# Altium schematic sheet PROC010B_DUT_Reference.SchDoc
size 431 x 279 mm; Date: Not shown in title block; ApprovedBy: Not shown in title block; CheckedBy: Not shown in title block; Author: Not shown in title block; CompanyName: Not shown in title block; DrawnBy: Adrian Ozer; Engineer: Not shown in title block; Organization: Not shown in title block; Address1: Not shown in title block; Address2: Not shown in title block; Address3: Not shown in title block; Address4: Not shown in title block; DocumentNumber: 2; Revision: Use project parameter SCH_Rev; SheetNumber: 2; SheetTotal: 16; PageSetup: Record=PageOptions|CenterHorizontal=True|CenterVertical=True|PrintScale=1.00|XCorrection=1.00|YCorrection=1.00|PrintKind=0|BorderSize=5000000|LeftOffset=0|BottomOffset=0|Orientation=2|PaperLength=1000|PaperWidth=1000|Scale=100|PaperSource=15|PrintQuality=600|MediaType=1|DitherType=10|PaperKind=Letter|PrintScaleMode=1; CurrentTime: Not shown in title block; CurrentDate: Not shown in title block; Time: Not shown in title block; DocumentFullPathAndName: Not shown in title block; DocumentName: Not shown in title block; ModifiedDate: Not shown in title block; ImagePath: Not shown in title block
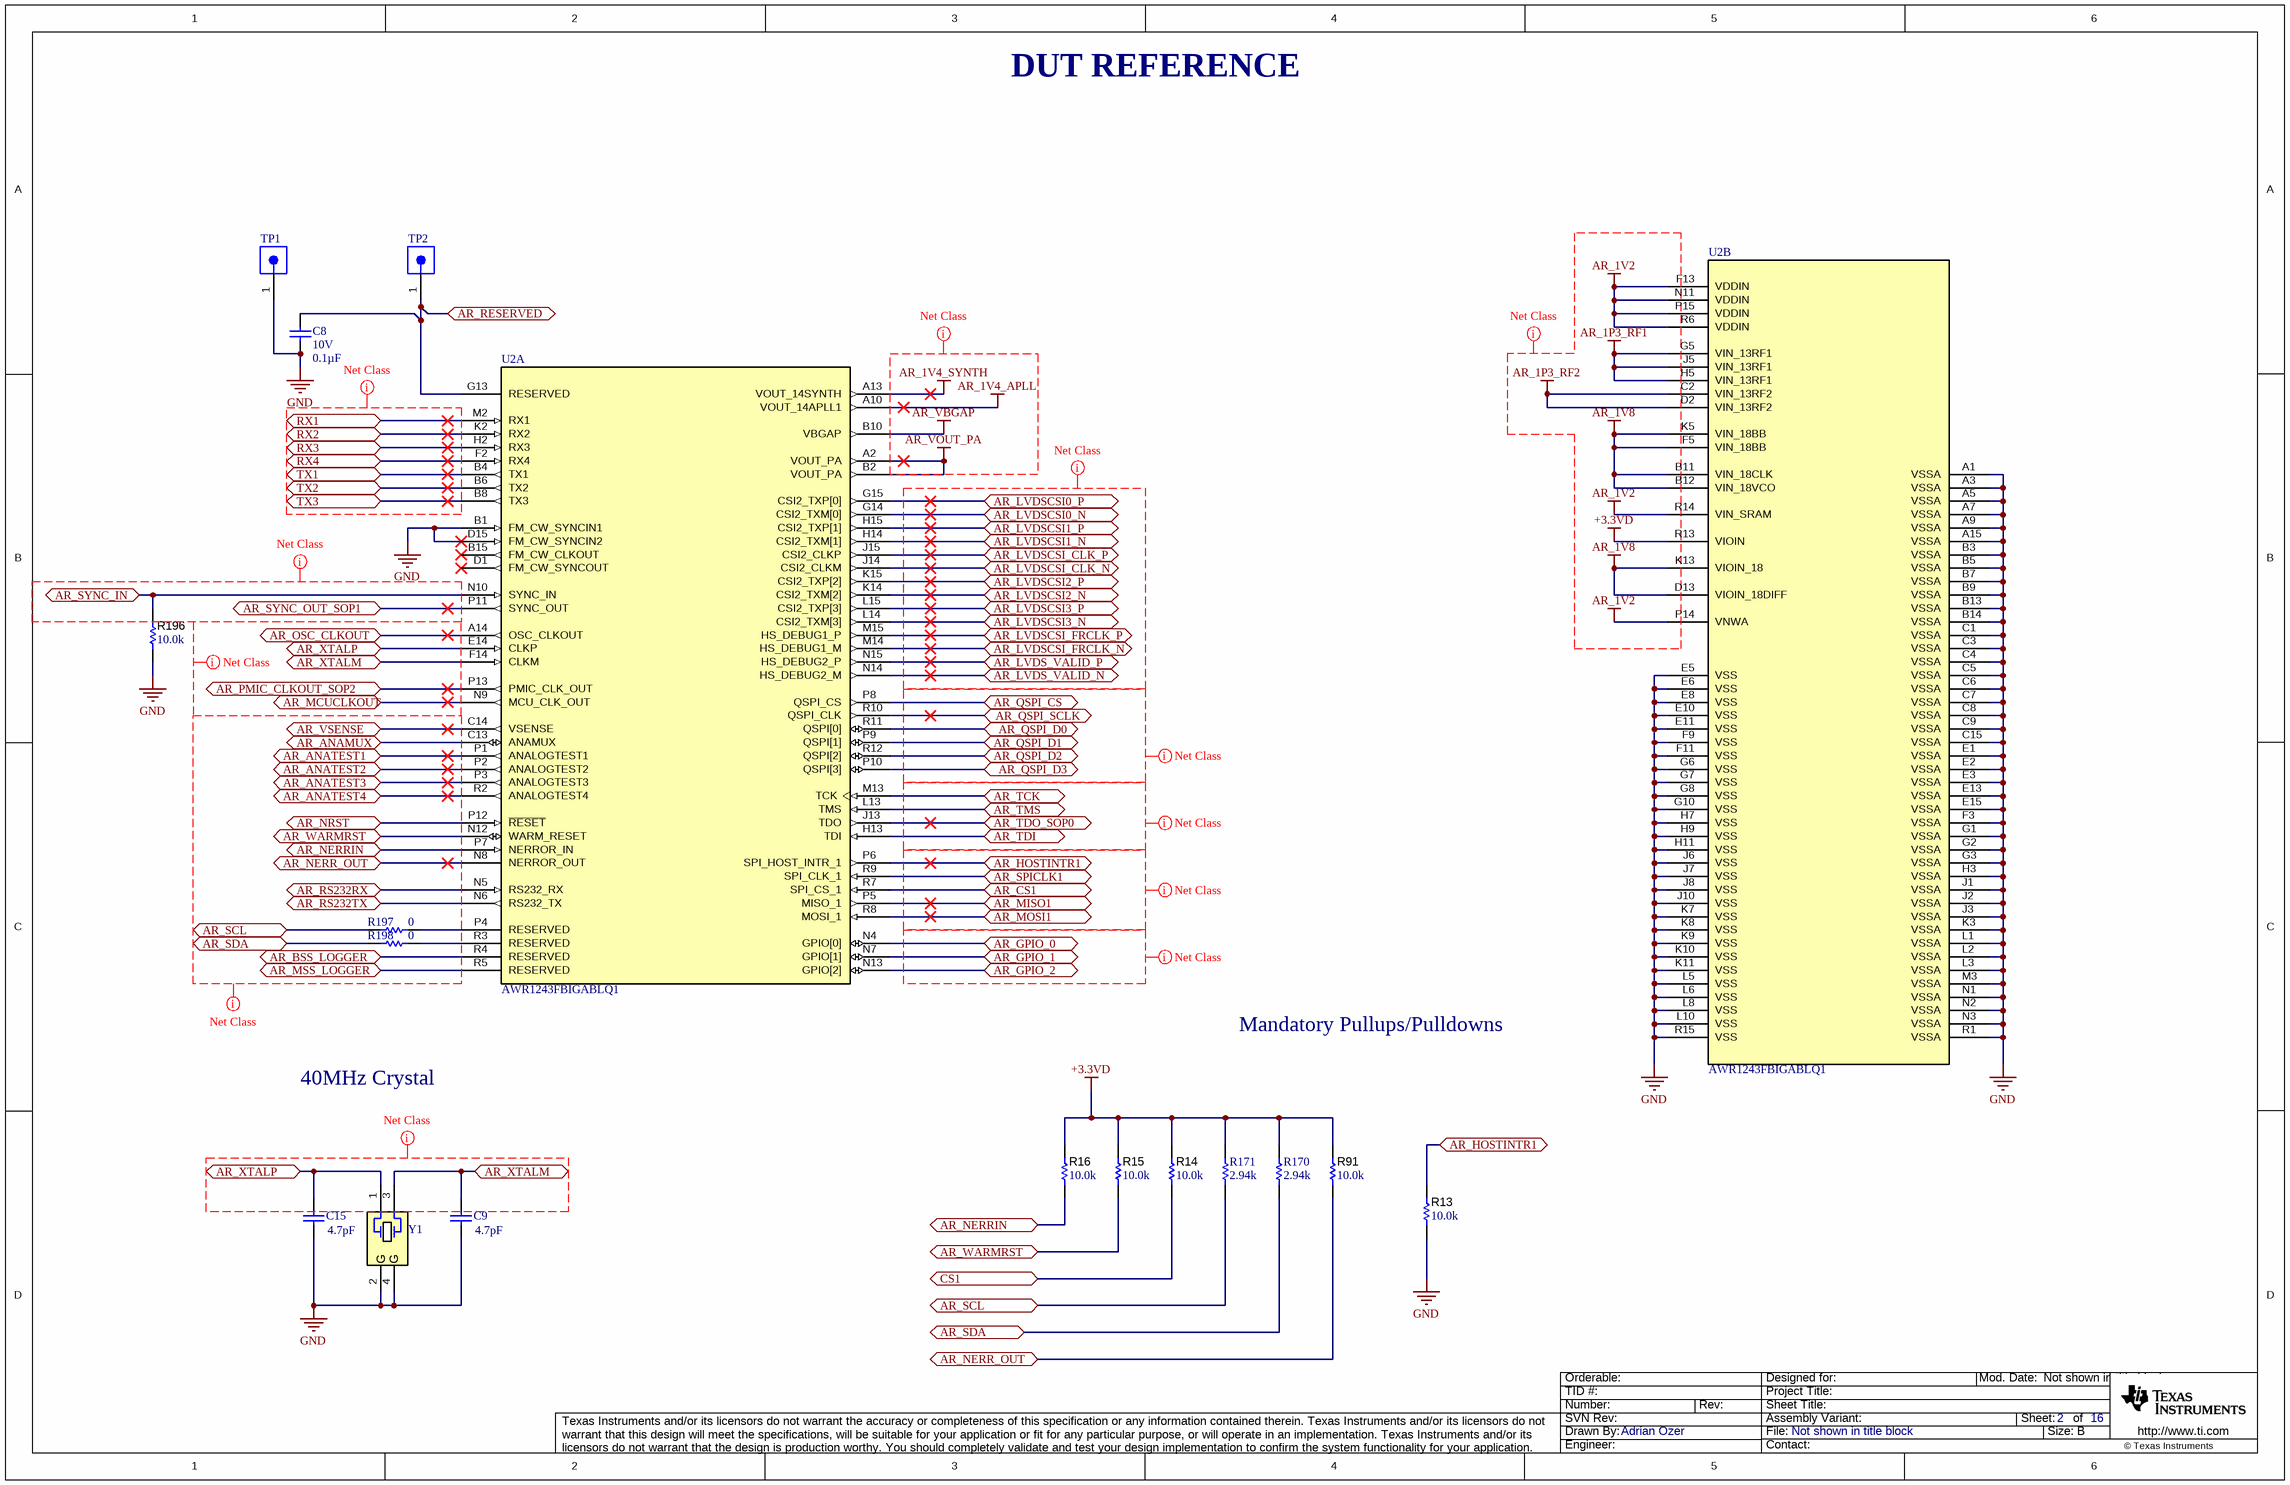
[diagram p0: PROC010B_DUT_Reference.SchDoc]

## Parts
C8  VDC_V: 10V  ValueDisplayed: 0.1µF  [0201_033]  (hidden comment: C0603X7S1A104K030BC)
C9  ValueDisplayed: 4.7pF  [0402]  (hidden comment: GJM1555C1H4R7BB01D)
C15  ValueDisplayed: 4.7pF  [0402]  (hidden comment: GJM1555C1H4R7BB01D)
R13  ValueDisplayed: 10.0k  [0402L]  (hidden comment: CRCW040210K0FKED)
R14  ValueDisplayed: 10.0k  [0402L]  (hidden comment: CRCW040210K0FKED)
R15  ValueDisplayed: 10.0k  [0402L]  (hidden comment: CRCW040210K0FKED)
R16  ValueDisplayed: 10.0k  [0402L]  (hidden comment: CRCW040210K0FKED)
R91  ValueDisplayed: 10.0k  [0402L]  (hidden comment: CRCW040210K0FKED)
R170  ValueDisplayed: 2.94k  [0402]  (hidden comment: CRCW04022K94FKED)
R171  ValueDisplayed: 2.94k  [0402]  (hidden comment: CRCW04022K94FKED)
R196  ValueDisplayed: 10.0k  [0402L]  (hidden comment: CRCW040210K0FKED)
R197  ValueDisplayed: 0  [0201]  (hidden comment: CRCW02010000Z0ED)
R198  ValueDisplayed: 0  [0201]  (hidden comment: CRCW02010000Z0ED)
TP1  TSW-101-17-T-S  [Samtec_TSW-101-17-T-S]  (value not drawn)
TP2  TSW-101-17-T-S  [Samtec_TSW-101-17-T-S]  (value not drawn)
U2  AWR1243FBIGABLQ1  [ABL0161A]  (parts A,B of 2)
Y1  CX3225SA40000D0PTWCC  [Kyocera_CX3225SA]  (value not drawn)

## Ports
AR_ANAMUX, AR_ANATEST1, AR_ANATEST2, AR_ANATEST3, AR_ANATEST4, AR_BSS_LOGGER, AR_CS1, AR_GPIO_0, AR_GPIO_1, AR_GPIO_2, AR_HOSTINTR1, AR_LVDS_VALID_N, AR_LVDS_VALID_P, AR_LVDSCSI0_N, AR_LVDSCSI0_P, AR_LVDSCSI1_N, AR_LVDSCSI1_P, AR_LVDSCSI2_N, AR_LVDSCSI2_P, AR_LVDSCSI3_N, AR_LVDSCSI3_P, AR_LVDSCSI_CLK_N, AR_LVDSCSI_CLK_P, AR_LVDSCSI_FRCLK_N, AR_LVDSCSI_FRCLK_P, AR_MCUCLKOUT, AR_MISO1, AR_MOSI1, AR_MSS_LOGGER, AR_NERR_OUT, AR_NERRIN, AR_NRST, AR_OSC_CLKOUT, AR_PMIC_CLKOUT_SOP2, AR_QSPI_CS, AR_QSPI_D0, AR_QSPI_D1, AR_QSPI_D2, AR_QSPI_D3, AR_QSPI_SCLK, AR_RESERVED, AR_RS232RX, AR_RS232TX, AR_SCL, AR_SDA, AR_SPICLK1, AR_SYNC_IN, AR_SYNC_OUT_SOP1, AR_TCK, AR_TDI, AR_TDO_SOP0, AR_TMS, AR_VSENSE, AR_WARMRST, AR_XTALM, AR_XTALP, CS1, RX1, RX2, RX3, RX4, TX1, TX2, TX3

## Nets
+3.3VD: R14.2 R15.2 R16.2 R91.2 R170.2 R171.2 U2.R13(VIOIN)
AR_1P3_RF1: U2.G5(VIN_13RF1) U2.H5(VIN_13RF1) U2.J5(VIN_13RF1)
AR_1P3_RF2: U2.C2(VIN_13RF2) U2.D2(VIN_13RF2)
AR_1V2: U2.F13(VDDIN) U2.N11(VDDIN) U2.P14(VNWA) U2.P15(VDDIN) U2.R6(VDDIN) U2.R14(VIN_SRAM)
AR_1V4_APLL: U2.A10(VOUT_14APLL1)
AR_1V4_SYNTH: U2.A13(VOUT_14SYNTH)
AR_1V8: U2.B11(VIN_18CLK) U2.B12(VIN_18VCO) U2.D13(VIOIN_18DIFF) U2.F5(VIN_18BB) U2.K5(VIN_18BB) U2.K13(VIOIN_18)
AR_VBGAP: U2.B10(VBGAP)
AR_VOUT_PA: U2.A2(VOUT_PA) U2.B2(VOUT_PA)
GND: C8.2 C9.2 C15.1 R13.1 R196.1 TP1.1 U2.A1(VSSA) U2.A3(VSSA) U2.A5(VSSA) U2.A7(VSSA) U2.A9(VSSA) U2.A15(VSSA) U2.B1(FM_CW_SYNCIN1) U2.B3(VSSA) U2.B5(VSSA) U2.B7(VSSA) U2.B9(VSSA) U2.B13(VSSA) U2.B14(VSSA) U2.C1(VSSA) U2.C3(VSSA) U2.C4(VSSA) U2.C5(VSSA) U2.C6(VSSA) U2.C7(VSSA) U2.C8(VSSA) U2.C9(VSSA) U2.C15(VSSA) U2.D15(FM_CW_SYNCIN2) U2.E1(VSSA) U2.E2(VSSA) U2.E3(VSSA) U2.E5(VSS) U2.E6(VSS) U2.E8(VSS) U2.E10(VSS) U2.E11(VSS) U2.E13(VSSA) U2.E15(VSSA) U2.F3(VSSA) U2.F9(VSS) U2.F11(VSS) U2.G1(VSSA) U2.G2(VSSA) U2.G3(VSSA) U2.G6(VSS) U2.G7(VSS) U2.G8(VSS) U2.G10(VSS) U2.H3(VSSA) U2.H7(VSS) U2.H9(VSS) U2.H11(VSS) U2.J1(VSSA) U2.J2(VSSA) U2.J3(VSSA) U2.J6(VSS) U2.J7(VSS) U2.J8(VSS) U2.J10(VSS) U2.K3(VSSA) U2.K7(VSS) U2.K8(VSS) U2.K9(VSS) U2.K10(VSS) U2.K11(VSS) U2.L1(VSSA) U2.L2(VSSA) U2.L3(VSSA) U2.L5(VSS) U2.L6(VSS) U2.L8(VSS) U2.L10(VSS) U2.M3(VSSA) U2.N1(VSSA) U2.N2(VSSA) U2.N3(VSSA) U2.R1(VSSA) U2.R15(VSS) Y1.2(GND) Y1.4(GND)
AR_ANAMUX: U2.C13(ANAMUX) ; port AR_ANAMUX
AR_ANATEST1: U2.P1(ANALOGTEST1) ; port AR_ANATEST1
AR_ANATEST2: U2.P2(ANALOGTEST2) ; port AR_ANATEST2
AR_ANATEST3: U2.P3(ANALOGTEST3) ; port AR_ANATEST3
AR_ANATEST4: U2.R2(ANALOGTEST4) ; port AR_ANATEST4
AR_BSS_LOGGER: U2.R4(RESERVED) ; port AR_BSS_LOGGER
AR_CS1: U2.R7(SPI_CS_1) ; port AR_CS1
AR_GPIO_0: U2.N4(GPIO[0]) ; port AR_GPIO_0
AR_GPIO_1: U2.N7(GPIO[1]) ; port AR_GPIO_1
AR_GPIO_2: U2.N13(GPIO[2]) ; port AR_GPIO_2
AR_HOSTINTR1: R13.2 U2.P6(SPI_HOST_INTR_1) ; port AR_HOSTINTR1
AR_LVDS_VALID_N: U2.N14(HS_DEBUG2_M) ; port AR_LVDS_VALID_N
AR_LVDS_VALID_P: U2.N15(HS_DEBUG2_P) ; port AR_LVDS_VALID_P
AR_LVDSCSI0_N: U2.G14(CSI2_TXM[0]) ; port AR_LVDSCSI0_N
AR_LVDSCSI0_P: U2.G15(CSI2_TXP[0]) ; port AR_LVDSCSI0_P
AR_LVDSCSI1_N: U2.H14(CSI2_TXM[1]) ; port AR_LVDSCSI1_N
AR_LVDSCSI1_P: U2.H15(CSI2_TXP[1]) ; port AR_LVDSCSI1_P
AR_LVDSCSI2_N: U2.K14(CSI2_TXM[2]) ; port AR_LVDSCSI2_N
AR_LVDSCSI2_P: U2.K15(CSI2_TXP[2]) ; port AR_LVDSCSI2_P
AR_LVDSCSI3_N: U2.L14(CSI2_TXM[3]) ; port AR_LVDSCSI3_N
AR_LVDSCSI3_P: U2.L15(CSI2_TXP[3]) ; port AR_LVDSCSI3_P
AR_LVDSCSI_CLK_N: U2.J14(CSI2_CLKM) ; port AR_LVDSCSI_CLK_N
AR_LVDSCSI_CLK_P: U2.J15(CSI2_CLKP) ; port AR_LVDSCSI_CLK_P
AR_LVDSCSI_FRCLK_N: U2.M14(HS_DEBUG1_M) ; port AR_LVDSCSI_FRCLK_N
AR_LVDSCSI_FRCLK_P: U2.M15(HS_DEBUG1_P) ; port AR_LVDSCSI_FRCLK_P
AR_MCUCLKOUT: U2.N9(MCU_CLK_OUT) ; port AR_MCUCLKOUT
AR_MISO1: U2.P5(MISO_1) ; port AR_MISO1
AR_MOSI1: U2.R8(MOSI_1) ; port AR_MOSI1
AR_MSS_LOGGER: U2.R5(RESERVED) ; port AR_MSS_LOGGER
AR_NERR_OUT: R91.1 U2.N8(NERROR_OUT) ; port AR_NERR_OUT
AR_NERRIN: R16.1 U2.P7(NERROR_IN) ; port AR_NERRIN
AR_NRST: U2.P12(~{RESET}) ; port AR_NRST
AR_OSC_CLKOUT: U2.A14(OSC_CLKOUT) ; port AR_OSC_CLKOUT
AR_PMIC_CLKOUT_SOP2: U2.P13(PMIC_CLK_OUT) ; port AR_PMIC_CLKOUT_SOP2
AR_QSPI_CS: U2.P8(QSPI_CS) ; port AR_QSPI_CS
AR_QSPI_D0: U2.R11(QSPI[0]) ; port AR_QSPI_D0
AR_QSPI_D1: U2.P9(QSPI[1]) ; port AR_QSPI_D1
AR_QSPI_D2: U2.R12(QSPI[2]) ; port AR_QSPI_D2
AR_QSPI_D3: U2.P10(QSPI[3]) ; port AR_QSPI_D3
AR_QSPI_SCLK: U2.R10(QSPI_CLK) ; port AR_QSPI_SCLK
AR_RESERVED: C8.1 TP2.1 U2.G13(RESERVED) ; port AR_RESERVED
AR_RS232RX: U2.N5(RS232_RX) ; port AR_RS232RX
AR_RS232TX: U2.N6(RS232_TX) ; port AR_RS232TX
AR_SCL: R171.1 R197.1 ; port AR_SCL
AR_SDA: R170.1 R198.1 ; port AR_SDA
AR_SPICLK1: U2.R9(SPI_CLK_1) ; port AR_SPICLK1
AR_SYNC_IN: R196.2 U2.N10(SYNC_IN) ; port AR_SYNC_IN
AR_SYNC_OUT_SOP1: U2.P11(SYNC_OUT) ; port AR_SYNC_OUT_SOP1
AR_TCK: U2.M13(TCK) ; port AR_TCK
AR_TDI: U2.H13(TDI) ; port AR_TDI
AR_TDO_SOP0: U2.J13(TDO) ; port AR_TDO_SOP0
AR_TMS: U2.L13(TMS) ; port AR_TMS
AR_VSENSE: U2.C14(VSENSE) ; port AR_VSENSE
AR_WARMRST: R15.1 U2.N12(WARM_RESET) ; port AR_WARMRST
AR_XTALM: C9.1 U2.F14(CLKM) Y1.3 ; port AR_XTALM
AR_XTALP: C15.2 U2.E14(CLKP) Y1.1 ; port AR_XTALP
CS1: R14.1 ; port CS1
RX1: U2.M2(RX1) ; port RX1
RX2: U2.K2(RX2) ; port RX2
RX3: U2.H2(RX3) ; port RX3
RX4: U2.F2(RX4) ; port RX4
TX1: U2.B4(TX1) ; port TX1
TX2: U2.B6(TX2) ; port TX2
TX3: U2.B8(TX3) ; port TX3
NetR197_2: R197.2 U2.P4(RESERVED)
NetR198_2: R198.2 U2.R3(RESERVED)

Not connected (* = marked no-connect by the designer): U2 B15(FM_CW_CLKOUT)* D1(FM_CW_SYNCOUT)*

## Layout directives
net class RF: (no net found under the mark)
net class GENERAL: (no net found under the mark)
net class SPI: (no net found under the mark)
net class PWR: +3.3VD, AR_1P3_RF1, AR_1P3_RF2, AR_1V2, AR_1V4_APLL, AR_1V4_SYNTH, AR_1V8, AR_VBGAP, AR_VOUT_PA
net class CLK: (no net found under the mark)
net class LVDS: (no net found under the mark)
net class QSPI: (no net found under the mark)
net class JTAG: (no net found under the mark)

## Notes on the sheet
- DUT REFERENCE
- Mandatory Pullups/Pulldowns
- 40MHz Crystal
- Drawn By:
- SVN Rev:
- Number:
- TID #:
- Orderable:
- Rev:
- Sheet Title:
- File:
- Project Title:
- Designed for:
- Assembly Variant:
- Mod. Date:
- Sheet:
- Size:
- of
- B
- http://www.ti.com
- Texas Instruments and/or its licensors do not warrant the accuracy or completeness of this specification or any information contained therein. Texas Instruments and/or its licensors do not warrant that this design will meet the specifications, will be suitable for your application or fit for any particular purpose, or will operate in an implementation. Texas Instruments and/or its licensors do not warrant that the design is production worthy. You should completely validate and test your design implementation to confirm the system functionality for your application.
- Engineer:
- Contact:
- © Texas Instruments
- (in symbol CMP-0004694-3) G

## Library data of the parts
C8 = CMP-0078219-1: CAP, CERM, 0.1 µF, 10 V,+/- 10%, X7S, 0201; Manufacturer: TDK; TaMin_C: -55°C; Polarized: N; Green_Lifecycle: NRND; SizeAreaWB_mm2: 2.08; Green_REACh: Passed; U/M: EA; Value: 0.1uF; TaMax_C: 125°C; SizeZ_mm: 0.33; SizeX_mm: 0.6; SizeY_mm: 0.3; Cap_Case: 0201; SizeArea_mm2: 0.18; Cap_F: 100nF; AEC Category: Q200; ComponentLink1URL: https://product.tdk.com/info/en/catalog/datasheets/mlcc_commercial_general_en.pdf; Supplier Part Number 2: 94Y9906; Supplier 2: Newark; Supplier Part Number 3: 810-C0603X7S1A104K; TempCo: X7S; Supplier 3: Mouser; RoHS: Y; MountType: SMT; Green_EU RoHS-2: Passed; Supplier 1: Digi-Key; Green_EU RoHS: Passed; PackageReference: 0201; Tolerance_%: 10%; Value2: 10V; CompType: Capacitor; PartNumber: C0603X7S1A104K030BC; AEC Qualified: N; ComponentLink1Description: Datasheet link; AEC Grade: N/A; Supplier Part Number 1: 445-9051-1-ND; Technology: Ceramic
C9 C15 = CMP-0006367-2: CAP, CERM, 4.7 pF, 50 V, +/- 2%, C0G/NP0, 0402; Manufacturer: MuRata; TaMin_C: -55°C; Polarized: N; SizeAreaWB_mm2: 3; Value1: Unknown; U/M: EA; Value: 4.7pF; TaMax_C: 125°C; SizeZ_mm: 0.6; SizeX_mm: 1; SizeY_mm: 0.5; Value2: 50V; CompType: Capacitor; AEC Category: Q200; Supplier Part Number 2: 81-GJM1555C1H4R7BB01; Publisher: Texas Instruments; Supplier 2: Mouser; TempCo: C0G/NP0; Published: 2008-06-19; RoHS: Y; MountType: SMT; Supplier 1: Digi-Key; PackageReference: 0402; Tolerance_%: 2%; Cap_Case: 0402; SizeArea_mm2: 0.5; LatestRevisionDate: 2017-03-09; PartNumber: GJM1555C1H4R7BB01D; AEC Qualified: N; Cap_F: 4.7pF; VDC_V: 50V; ComponentLink1Description: Datasheet link; AEC Grade: N/A; Supplier Part Number 1: 490-8102-1-ND; Technology: Ceramic; ComponentLink1URL: http://psearch.murata.com/capacitor/product/GJM1555C1H4R7BB01%23.pdf
R13-R16 R91 = CMP-0025958-3: RES, 10.0 k, 1%, 0.063 W, AEC-Q200 Grade 0, 0402; Manufacturer: Vishay-Dale; Power_W: 63mW; TempCo: 100 ppm/C; Value_Code: 10k0; Value: 10.0k; EIA_Code: E96; Res_ohm: 10k; SizeX_mm: 1; SizeY_mm: 0.5; SizeZ_mm: 0.6; Value2: 0.063W; AEC Qualified: Y; VDC_V: 50V; AEC Category: Q200; AEC Grade: 0; Supplier Part Number 2: 52K6595; Supplier 2: Newark; Supplier Part Number 3: 71-CRCW0402-10K-E3; Supplier 3: Mouser; RoHS: E; Value1: 1%; MountType: SMT; Supplier 1: Digi-Key; PackageReference: 0402; Tolerance_%: 1%; SizeArea_mm2: 0.5; CompType: Resistor; PartNumber: CRCW040210K0FKED; ComponentLink1Description: Datasheet link; Supplier Part Number 1: 541-10.0KLCT-ND; Technology: Thick Film; ComponentLink1URL: http://www.vishay.com/docs/20035/dcrcwe3.pdf
R170 R171 = CMP-0026244-2: RES, 2.94 k, 1%, 0.063 W, AEC-Q200 Grade 0, 0402; Manufacturer: Vishay-Dale; Power_W: 63mW; TempCo: 100 ppm/C; Value_Code: 2k94; Value: 2.94k; EIA_Code: E96; SizeX_mm: 1; SizeY_mm: 0.5; SizeZ_mm: 0.6; Value2: 0.063W; AEC Qualified: Y; VDC_V: 50V; AEC Category: Q200; AEC Grade: 0; ComponentLink1URL: http://www.vishay.com/docs/20035/dcrcwe3.pdf; Supplier Part Number 2: 52K6814; Supplier 2: Newark; Supplier Part Number 3: 71-CRCW0402-2.94K-E3; Supplier 3: Mouser; RoHS: E; Value1: 1%; MountType: SMT; Supplier 1: Digi-Key; PackageReference: 0402; Tolerance_%: 1%; Res_ohm: 2.94k; SizeArea_mm2: 0.5; CompType: Resistor; PartNumber: CRCW04022K94FKED; ComponentLink1Description: Datasheet link; Supplier Part Number 1: 541-2.94KLCT-ND; Technology: Thick Film
R196 = CMP-0025958-3: RES, 10.0 k, 1%, 0.063 W, AEC-Q200 Grade 0, 0402; Manufacturer: Vishay-Dale; Power_W: 63mW; TempCo: 100 ppm/C; Value_Code: 10k0; Value: 10.0k; EIA_Code: E96; Res_ohm: 10k; SizeX_mm: 1; SizeY_mm: 0.5; SizeZ_mm: 0.6; Value2: 0.063W; CompType: Resistor; AEC Qualified: Y; VDC_V: 50V; AEC Category: Q200; AEC Grade: 0; Supplier Part Number 2: 52K6595; Supplier 2: Newark; Supplier Part Number 3: 71-CRCW0402-10K-E3; Supplier 3: Mouser; RoHS: E; Value1: 1%; MountType: SMT; Supplier 1: Digi-Key; PackageReference: 0402; Tolerance_%: 1%; SizeArea_mm2: 0.5; PartNumber: CRCW040210K0FKED; ComponentLink1Description: Datasheet link; Supplier Part Number 1: 541-10.0KLCT-ND; Technology: Thick Film; ComponentLink1URL: http://www.vishay.com/docs/20035/dcrcwe3.pdf
R197 R198 = CMP-0027008-4: RES, 0, 5%, 0.05 W, 0201; Manufacturer: Vishay-Dale; Power_W: 50mW; TempCo: ppm/C; Value_Code: 0000; Value: 0; EIA_Code: E24; SizeX_mm: 0.6; SizeY_mm: 0.3; SizeZ_mm: 0.26; Value2: 0.05W; SizeArea_mm2: 0.18; AEC Qualified: N; AEC Category: Q200; RoHS: E; Value1: 5%; MountType: SMT; Supplier 1: Newark; PackageReference: 0201; Tolerance_%: 5%; Res_ohm: 0; CompType: Resistor; PartNumber: CRCW02010000Z0ED; ComponentLink1Description: Datasheet link; AEC Grade: N/A; Supplier Part Number 1: 72M6743; Technology: Thick Film; ComponentLink1URL: http://www.vishay.com/docs/20052/crcw0201e3.pdf
TP1 TP2 = CMP-0055993-1: Header, 100mil, 1x1, Tin, TH; Manufacturer: Samtec; Cert_VDE: N; CNHeader: FALSE; Current_A: 6.3A; Green_Lifecycle: Active; Gender: Male; Cert_CSA: Y; Green_REACh: Passed; Voltage_V: 550V; Row_Count: 1; Pitch_mm: 2.54; ComponentLink1URL: http://www.samtec.com/documents/webfiles/cpdf/TSW-XXX-XX-XXX-X-XX-XXX-MKT.pdf; Supplier Part Number 2: 12P1227; Publisher: Texas Instruments; Supplier 2: Newark; Shrouded: N; Supplier Part Number 3: 2038061; Color: Black; Supplier 3: Farnell; Cert_CULUS: N; RoHS: Y; MountType: TH; Green_EU RoHS-2: Passed; Supplier 1: Digi-Key; Green_EU RoHS: Passed; PackageReference: 2.54mm Header; PinCount: 1; CompType: Header; LatestRevisionDate: 26/05/2017; PartNumber: TSW-101-17-T-S; Orientation: Vertical; ComponentLink1Description: Datasheet URL; Supplier Part Number 1: SAM1067-01-ND; ContactFinish: Tin; CT: FALSE; Cert_UL: Y
U2 = CMP-0081285-1: Single Chip 77 and 79 GHz FMCW Transceiver, ABL0161A (FCBGA-161); Alternate PartNumber: AWR1243FBIGABLRQ1; Alternate Manufacturer: Texas Instruments; SizeAreaWB_mm2: 153.76; SizeZ_mm: 1.17; SizeX_mm: 10.4; SizeArea_mm2: 108.16; CompType: IC; AEC Qualified: N; AEC Category: Q200; ComponentLink1URL: http://www.ti.com/lit/ds/symlink/awr1243.pdf; PackageDescription: FCBGA-161; MountType: SMT; ComponentLink2URL: http://www.ti.com/product/awr1243; ComponentLink3Description: Online Datasheet; ComponentLink2Description: Product Folder; Manufacturer: Texas Instruments; ComponentLink3URL: http://www.ti.com/product/awr1243/datasheet; PackageReference: ABL0161A; SizeY_mm: 10.4; PartNumber: AWR1243FBIGABLQ1; ComponentLink1Description: Datasheet Link; PartId: 1
Y1 = CMP-0004694-3: Crystal, 40 MHz, 8pF, SMD; Manufacturer: Kyocera; TaMin_C: -40°C; Frequency Stability: +/-200ppm; SizeAreaWB_mm2: 14.7; Frequency_Fixed: 40MHz; TaMax_C: 125°C; SizeZ_mm: 0.8; SizeX_mm: 2.5; SizeY_mm: 3.2; SizeArea_mm2: 8; RoHS: Y; MountType: SMT; Supplier 1: Mouser; PackageReference: 3.2x2.5mm; CompType: Crystal; PartNumber: CX3225SA40000D0PTWCC; ComponentLink1Description: Datasheet Link; Supplier Part Number 1: 581-CX3225SA40D0PTWC; ComponentLink1URL: http://www.kyocera-crystal.jp/eng/wp-content/uploads/2016/10/cx3225sa_e.pdf